# Altium project Audio module.PrjPcb
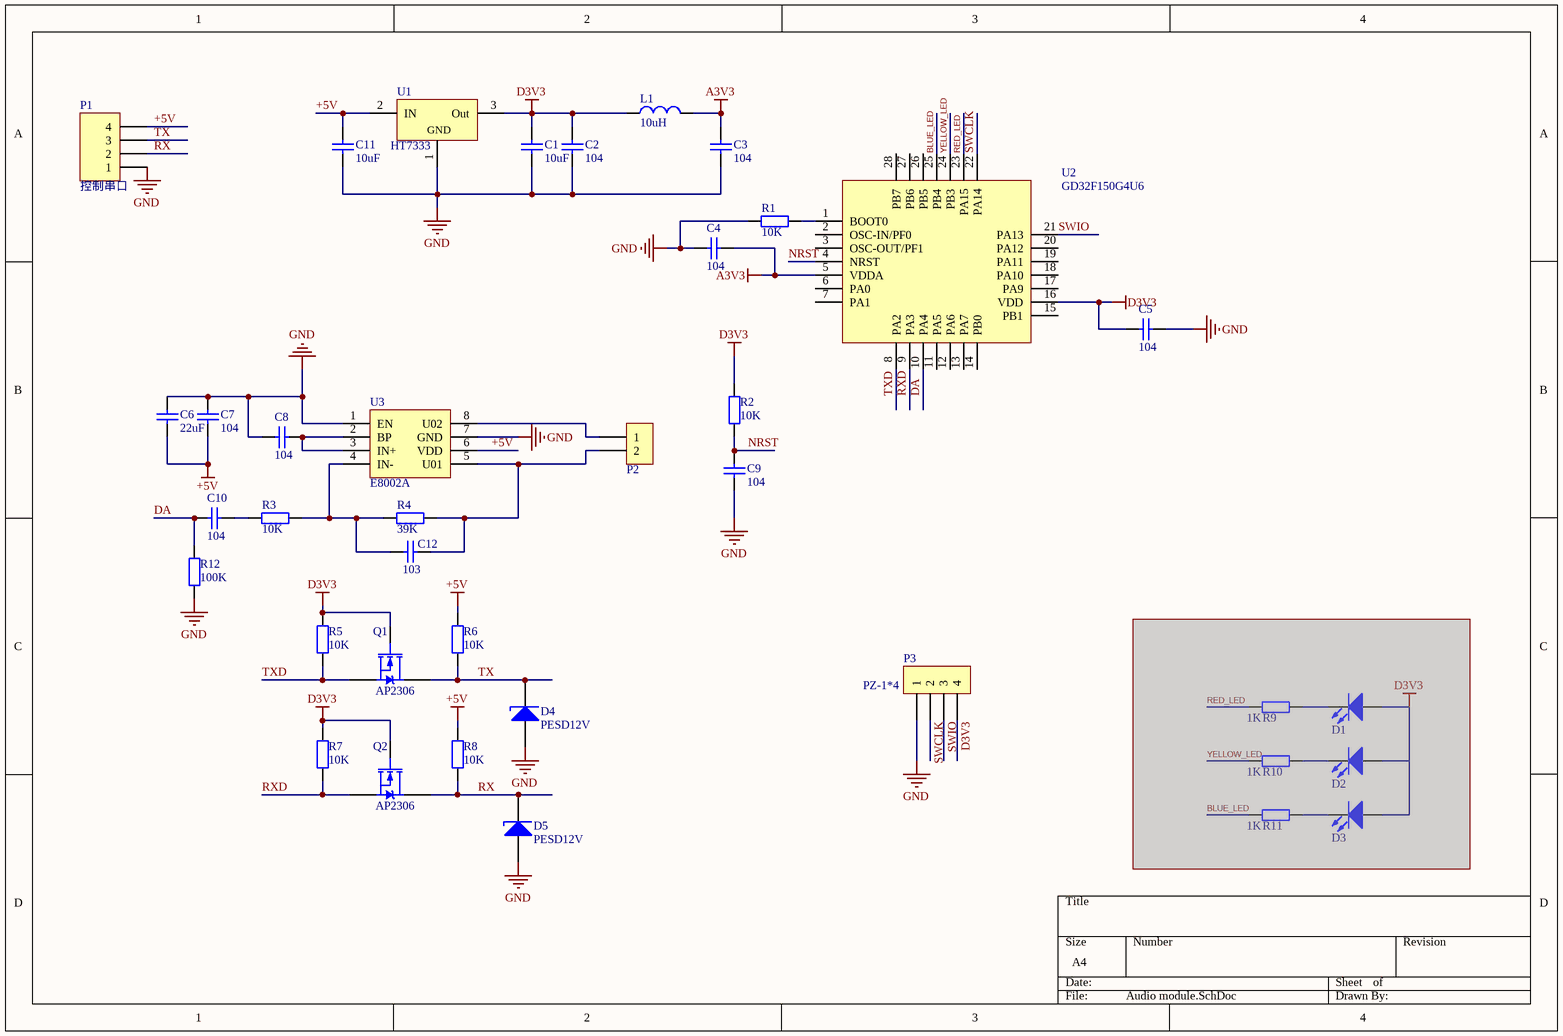
[diagram p0: Audio module.SchDoc]
1 sheet, 38 parts. Net scope: global (net labels, ports and power ports of the same name join across sheets).
Board file: Audio module V1.1.PcbDoc

## Sheet Audio module.SchDoc
size A4

### Parts
C1  value 10uF  [0603c]  (hidden comment: Cap)
C2  value 104  [0603c]  (hidden comment: Cap)
C3  value 104  [0603c]  (hidden comment: Cap)
C4  value 104  [0603c]  (hidden comment: Cap)
C5  value 104  [0603c]  (hidden comment: Cap)
C6  value 22uF  [0603c]  (hidden comment: Cap)
C7  value 104  [0603c]  (hidden comment: Cap)
C8  value 104  [0603c]  (hidden comment: Cap)
C9  value 104  [0603c]  (hidden comment: Cap)
C10  value 104  [0603c]  (hidden comment: Cap)
C11  value 10uF  [0603c]  (hidden comment: Cap)
C12  value 103  [0603c]  (hidden comment: Cap)
D1  RED_LED  [0603LED]  (value not drawn)  (masked out: inside a compile mask, not in the netlist)
D2  YELLOW_LED  [0603LED]  (value not drawn)  (masked out: inside a compile mask, not in the netlist)
D3  BLUE_LED  [0603led]  (value not drawn)  (masked out: inside a compile mask, not in the netlist)
D4  PESD12V  [sod323]
D5  PESD12V  [sod323]
L1  value 10uH  [0805-1]  (hidden comment: Inductor)
P1  控制串口  [PH2.0-4P]
P2  PZ-1*2  [HDR2X1_A]  (value not drawn)
P3  PZ-1*4  [HDR4X1_A]
Q1  AP2306  [SOT-23]
Q2  AP2306  [SOT-23]
R1  10K  [0603-1]
R2  10K  [0603-1]
R3  10k  [0603-1]
R4  39k  [0603-1]
R5  10K  [0603-1]
R6  10K  [0603-1]
R7  10K  [0603-1]
R8  10K  [0603-1]
R9  1K  [RES_0603]  (masked out: inside a compile mask, not in the netlist)
R10  1K  [RES_0603]  (masked out: inside a compile mask, not in the netlist)
R11  1K  [RES_0603]  (masked out: inside a compile mask, not in the netlist)
R12  100K  [0603-1]
U1  HT7333  [SOT89]
U2  GD32F150G4U6  [QFN28-1]
U3  E8002A  [SOP-8]

### Nets
+5V: C6.2 C7.1 C11.2 P1.4 R6.2 R8.2 U1.2(IN) U3.6(VDD)
A3V3: C3.2 C4.1 L1.2 U2.5(VDDA)
D3V3: C1.2 C2.2 C5.2 L1.1 P3.4 Q1.1(G) Q2.1(G) R2.2 R5.2 R7.2 U1.3(Out) U2.16(VDD)
GND: C1.1 C2.1 C3.1 C4.2 C5.1 C6.1 C7.2 C8.2 C9.1 C11.1 D4.1(A) D5.1(A) P1.1 P3.1 R1.2 R12.1 U1.1 U3.1(EN) U3.7(GND)
BLUE_LED: U2.25(PB4)
DA: C10.2 R12.2 U2.10(PA4)
NRST: C9.2 R2.1 U2.4(NRST)
RED_LED: U2.23(PA15)
RX: D5.2(K) P1.2 Q2.3(D) R8.1
RXD: Q2.2(S) R7.1 U2.9(PA3)
SWCLK: P3.2 U2.22(PA14)
SWIO: P3.3 U2.21(PA13)
TX: D4.2(K) P1.3 Q1.3(D) R6.1
TXD: Q1.2(S) R5.1 U2.8(PA2)
YELLOW_LED: U2.24(PB3)
NetC8_1: C8.1 U3.2(BP) U3.3(IN+)
NetC10_1: C10.1 R3.1
NetC12_1: C12.1 P2.2 R4.2 U3.5(U01)
NetC12_2: C12.2 R3.2 R4.1 U3.4(IN-)
NetP2_1: P2.1 U3.8(U02)
NetR1_1: R1.1 U2.1(BOOT0)

Not connected (* = marked no-connect by the designer): U2 2(OSC-IN/PF0) 3(OSC-OUT/PF1) 6(PA0) 7(PA1) 11(PA5) 12(PA6) 13(PA7) 14(PB0) 15(PB1) 17(PA9) 18(PA10) 19(PA11) 20(PA12) 26(PB5) 27(PB6) 28(PB7)

### Notes on the sheet
- (in symbol HT7333) GND

### Library data of the parts
C1-C12 = Cap: 无极性电容; Published: 8-Jun-2000; LatestRevisionDate: 17-Jul-2002; LatestRevisionNote: Re-released for DXP Platform.; PackageReference: RAD-0.3; Publisher: Altium Limited
D1-D3 = LED
D4 D5 = Diode-Z: TVS管; Value: 15V; Published: 8-Jun-2000; LatestRevisionDate: 17-Jul-2002; LatestRevisionNote: Re-released for DXP Platform.; PackageReference: SMB; Publisher: Altium Limited; Code_JEDEC: DO-214-AA
L1 = Inductor: 电感; Code_IEC: 1005; Published: 8-Jun-2000; LatestRevisionDate: 17-Jul-2002; LatestRevisionNote: Re-released for DXP Platform.; PackageReference: 0402-A; Publisher: Altium Limited; Code_JEITA: 0402
P1 = Header4
Q1 Q2 = MOSFET-N1: N-MOSFET1; PackageDocument: 1995/1996; Published: 8-Jun-2000; LatestRevisionDate: 17-Jul-2002; LatestRevisionNote: Re-released for DXP Platform.; PackageReference: E3; Publisher: Altium Limited
R1-R8 R12 = Res1: 贴片电阻; Published: 8-Jun-2000; LatestRevisionDate: 17-Jul-2002; LatestRevisionNote: Re-released for DXP Platform.; PackageReference: AXIAL-0.4; Publisher: Altium Limited
  R1-R3 R5-R8: Value: 10K
  R4: Value: 39K
  R12: Value: 100K
R9-R11 = RES: value: 1K
U1 = HT7333: LDO